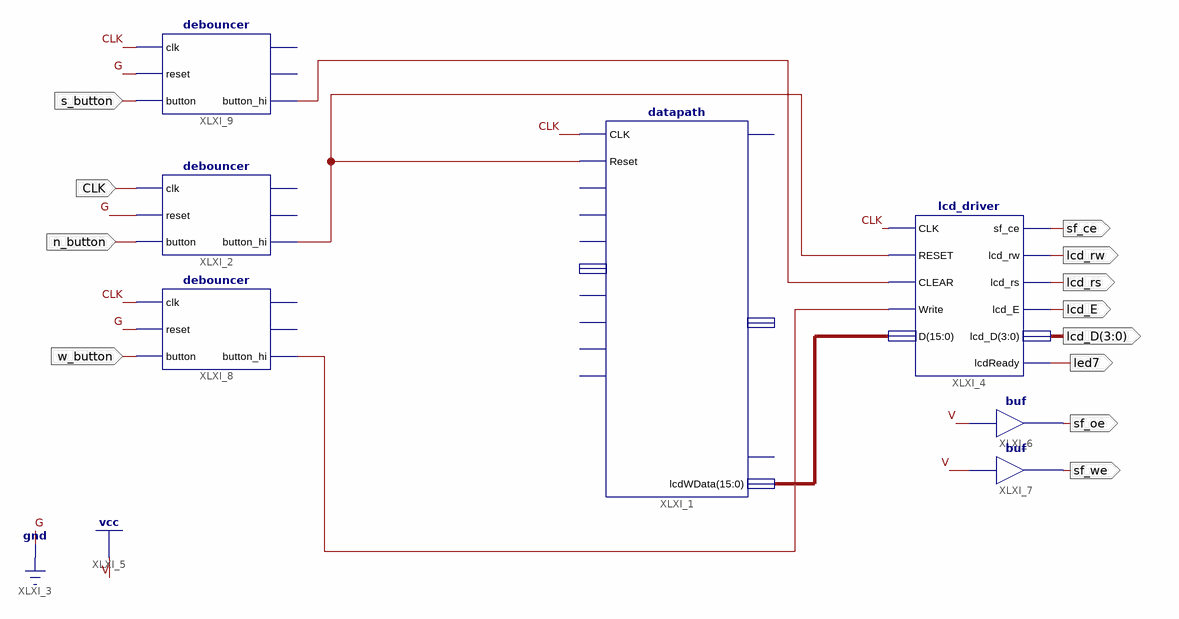
[diagram p0: schematic sheet 1]
// Xilinx ISE schematic datapathtest.sch (spartan3e) as structural Verilog: 7 symbols, 12 ports
module datapathtest (
  input  CLK,
  input  n_button,
  input  s_button,
  input  w_button,
  output lcd_rw,
  output sf_ce,
  output [3:0] lcd_D,
  output led7,
  output lcd_rs,
  output lcd_E,
  output sf_oe,
  output sf_we
);

  wire XLXN_13, XLXN_40, XLXN_41;
  wire [15:0] XLXN_10;

  datapath XLXI_1 (
    .CLK(CLK), .Reset(XLXN_13), .lcdWData(XLXN_10));  // open: intWrite, int0, int1, int2, int3, intDataIn, intLvl1, intLvl0, intr, intDataOut, syscallW
  debouncer XLXI_2 (.clk(CLK), .reset(1'b0), .button(n_button), .button_hi(XLXN_13));  // open: debutton, button_lo
  lcd_driver XLXI_4 (
    .CLK(CLK), .RESET(XLXN_13), .CLEAR(XLXN_41), .Write(XLXN_40), .D(XLXN_10), .lcd_E(lcd_E),
    .lcd_rs(lcd_rs), .lcdReady(led7), .lcd_D(lcd_D), .sf_ce(sf_ce), .lcd_rw(lcd_rw));
  buf XLXI_6 (sf_oe, 1'b1);
  buf XLXI_7 (sf_we, 1'b1);
  debouncer XLXI_9 (.clk(CLK), .reset(1'b0), .button(s_button), .button_hi(XLXN_41));  // open: debutton, button_lo
  debouncer XLXI_8 (.clk(CLK), .reset(1'b0), .button(w_button), .button_hi(XLXN_40));  // open: debutton, button_lo
endmodule
